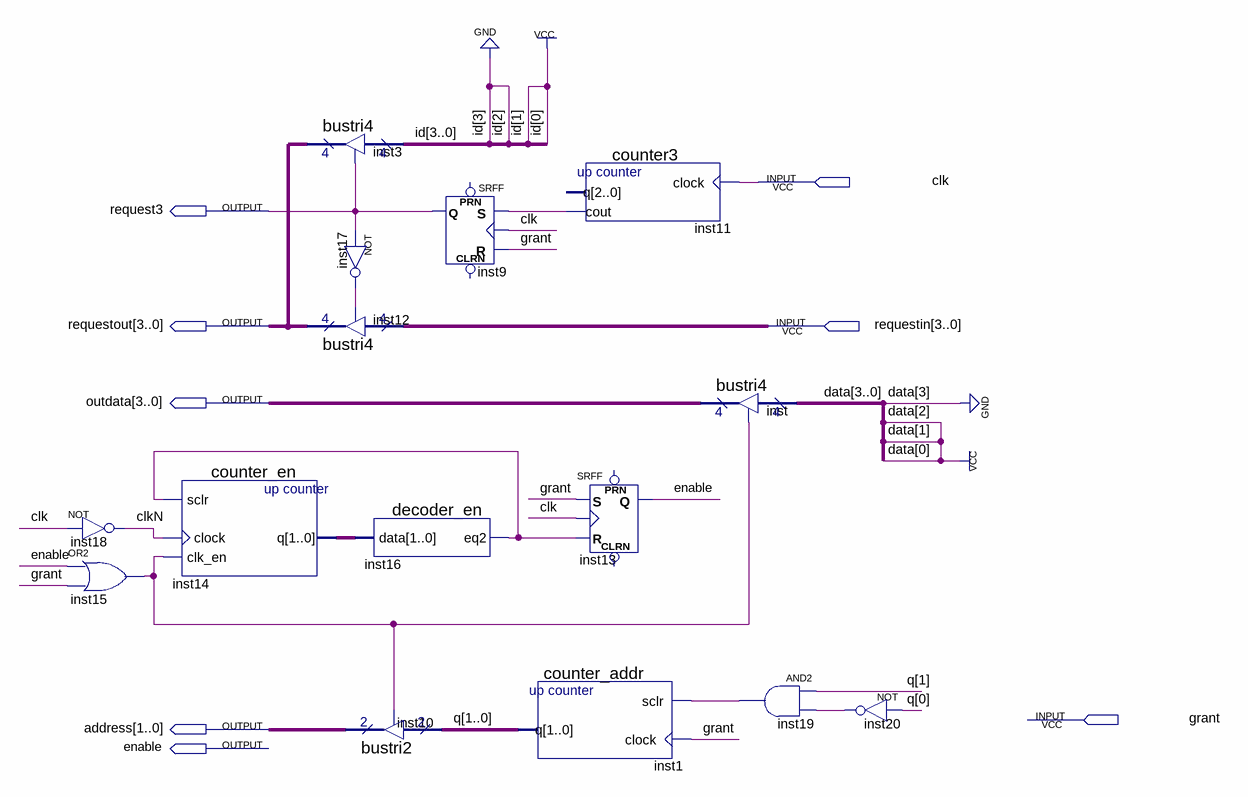
[diagram p0: schematic sheet]
// Quartus schematic master3.bdf as structural Verilog: 15 symbols, 8 pins
module master3 (
  input  clk,
  input  [3:0] requestin,
  input  grant,
  output request3,
  output [3:0] requestout,
  output [3:0] outdata,
  output [1:0] address,
  output enable
);

  wire clkN, inst11_cout, inst15_out, inst16_eq2, inst17_out, inst19_out, inst20_out;
  wire [1:0] inst14_q, q;

  not inst18 (clkN, clk);
  or inst15 (inst15_out, enable, grant);
  counter_en inst14 (.sclr(inst16_eq2), .clock(clkN), .clk_en(inst15_out), .q(inst14_q));
  bustri4 inst3 (.enabledt(request3), .data(4'b0011), .tridata(requestout));
  not inst17 (inst17_out, request3);
  bustri4 inst12 (.enabledt(inst17_out), .data(requestin), .tridata(requestout));
  decoder_en inst16 (.data(inst14_q), .eq2(inst16_eq2));
  bustri2 inst10 (.enabledt(inst15_out), .data(q), .tridata(address));
  SRFF inst9 (.S(inst11_cout), .R(grant), .CLK(clk), .Q(request3));  // open: PRN, CLRN
  counter3 inst11 (.clock(clk), .cout(inst11_cout));  // open: q
  counter_addr inst1 (.sclr(inst19_out), .clock(grant), .q(q));
  SRFF inst13 (.S(grant), .R(inst16_eq2), .CLK(clk), .Q(enable));  // open: PRN, CLRN
  bustri4 inst (.enabledt(inst15_out), .data(4'b0111), .tridata(outdata));
  and inst19 (inst19_out, q[1], inst20_out);
  not inst20 (inst20_out, q[0]);
endmodule
